# EAGLE design air (EAGLE 7.5.0)
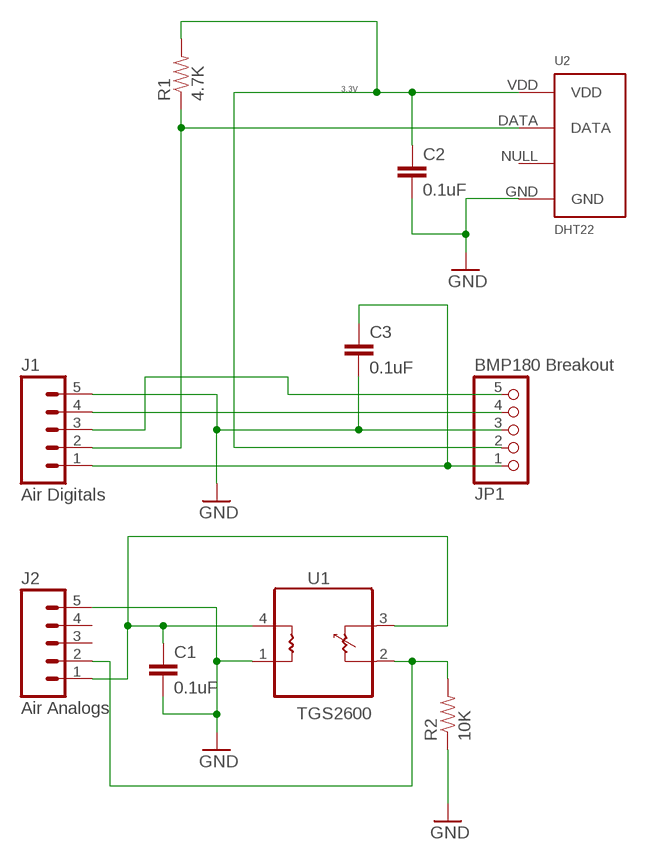
[diagram p0: schematic, sheet 1]

## Parts
C1  0.1uF  CAPPTH  [CAP-PTH-SMALL]
C2  0.1uF  CAPPTH  [CAP-PTH-SMALL]
C3  0.1uF  CAPPTH  [CAP-PTH-SMALL]
J1  Air Digitals  M05SCREW  [SCREWTERMINAL-3.5MM-5]
J2  Air Analogs  M05SCREW  [SCREWTERMINAL-3.5MM-5]
JP1  BMP180 Breakout  HEADER-1X570MIL  [1X05_ROUND_70]
R1  4.7K  RESISTORPTH-1/4W  [AXIAL-0.4]
R2  10K  RESISTORPTH-1/4W  [AXIAL-0.4]
U1  TGS2600  TGN2600  [TO5_AIRQ]
U2  DHT22  RHT03_DHT-22_AM2302WIRED  [AM2302]

## Nets
3.3V: C2.1 JP1.2 R1.P$2 U2.VDD
GND [power]: C1.2 C2.2 C3.2 J1.5 J2.5 JP1.3 R2.P$1 U1.1 U2.GND
N$1 [power]: C3.1 J1.1 JP1.1
N$2: J1.4 JP1.4
N$3: J1.2 R1.P$1 U2.DATA
N$4: J2.2 R2.P$2 U1.2
N$8 [power]: C1.1 J2.1 U1.3 U1.4
SDA: J1.3 JP1.5
Unconnected: J2.3 J2.4 U2.NULL

## Library data of the parts
C1-C3 = SparkFun-Capacitors:CAP: Capacitor Standard 0603 ceramic capacitor, and 0.1" leaded capacitor.
J1 J2 = SparkFun-Connectors:M05: Header 5 Standard 5-pin 0.1" header. Use with straight break away headers (SKU : PRT-00116), right angle break away headers (PRT-00553), swiss pins (PRT-00743), machine pins (PRT-00117), and female headers (PRT-00115). Molex polarized connector foot print use with SKU : PRT-08230 with associated crimp pins and housings.; PROD_ID: Combine 8288+8399
JP1 = microbuilder:HEADER-1X5: PIN HEADER
R1 R2 = SparkFun-Passives:RESISTOR: Resistor Basic schematic elements and footprints for 0603, 1206, and PTH resistors.
U1 = Jims:TGN2600
U2 = RHT03_DHT-22_AM2302:RHT03_DHT-22_AM2302: RHT03 / DHT-22 / AM2302 Packages and symbol for the RHT03 / DHT-22 relative humidity and temperature sensor. Note: The AM2302 is a wired version of the DHT-22 which typically requires less clearance and is thus provided as a separate package.; PROD_ID: SEN-10167

## Net classes
0 default: width 0.305 mm
1 power: width 1.016 mm

## Board
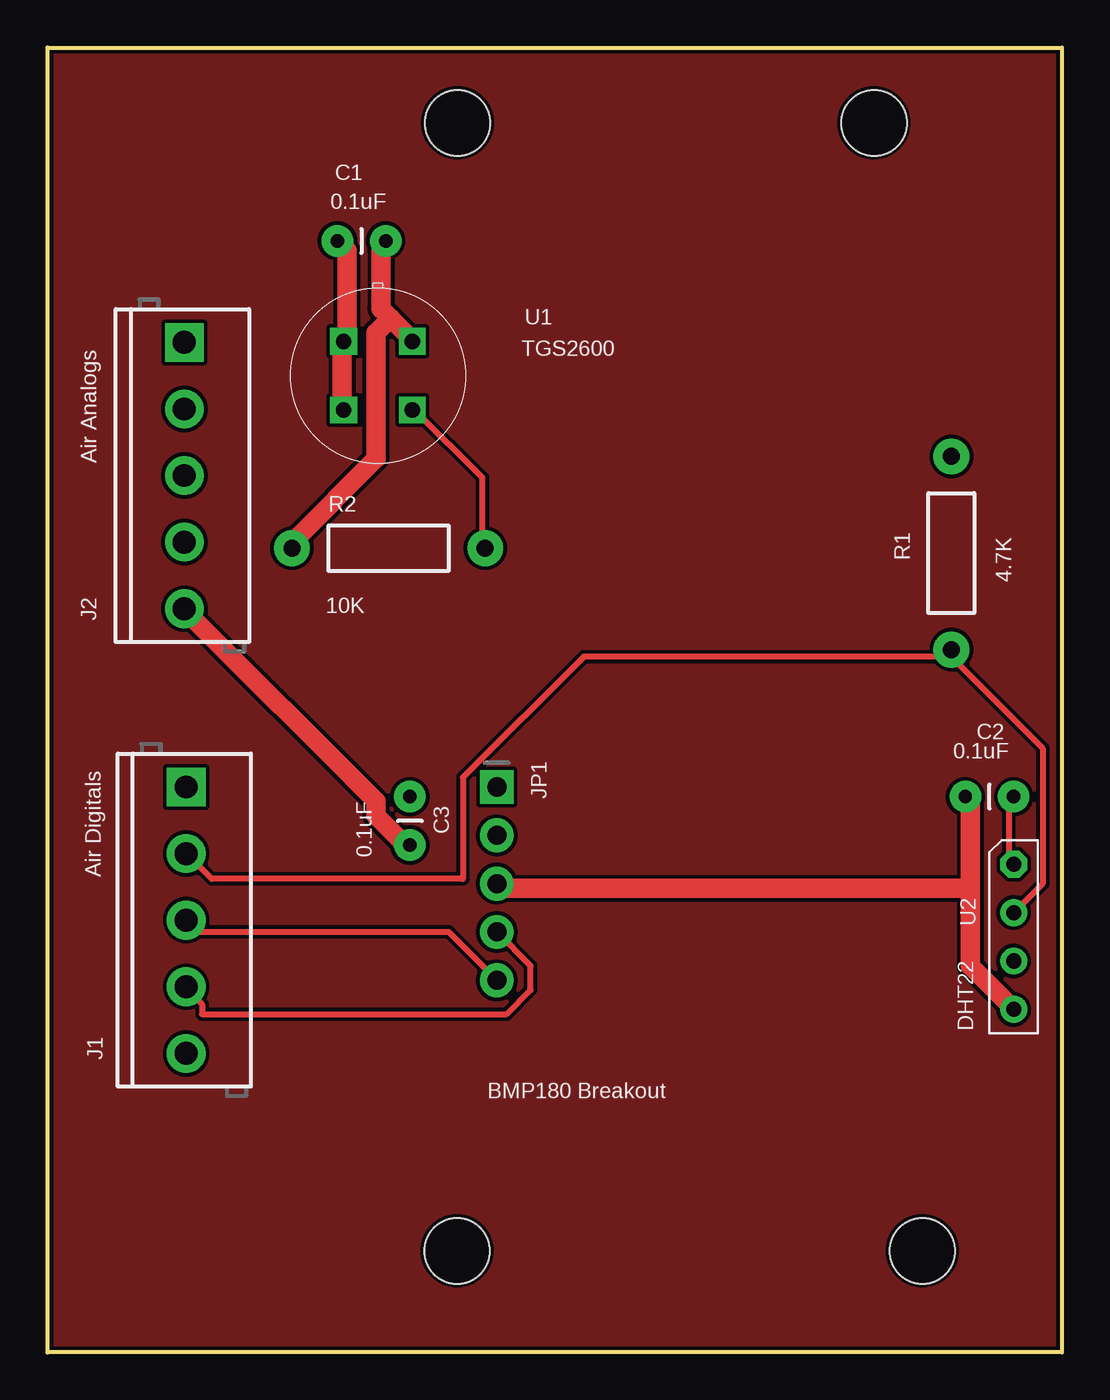
[diagram p1: board, top side]
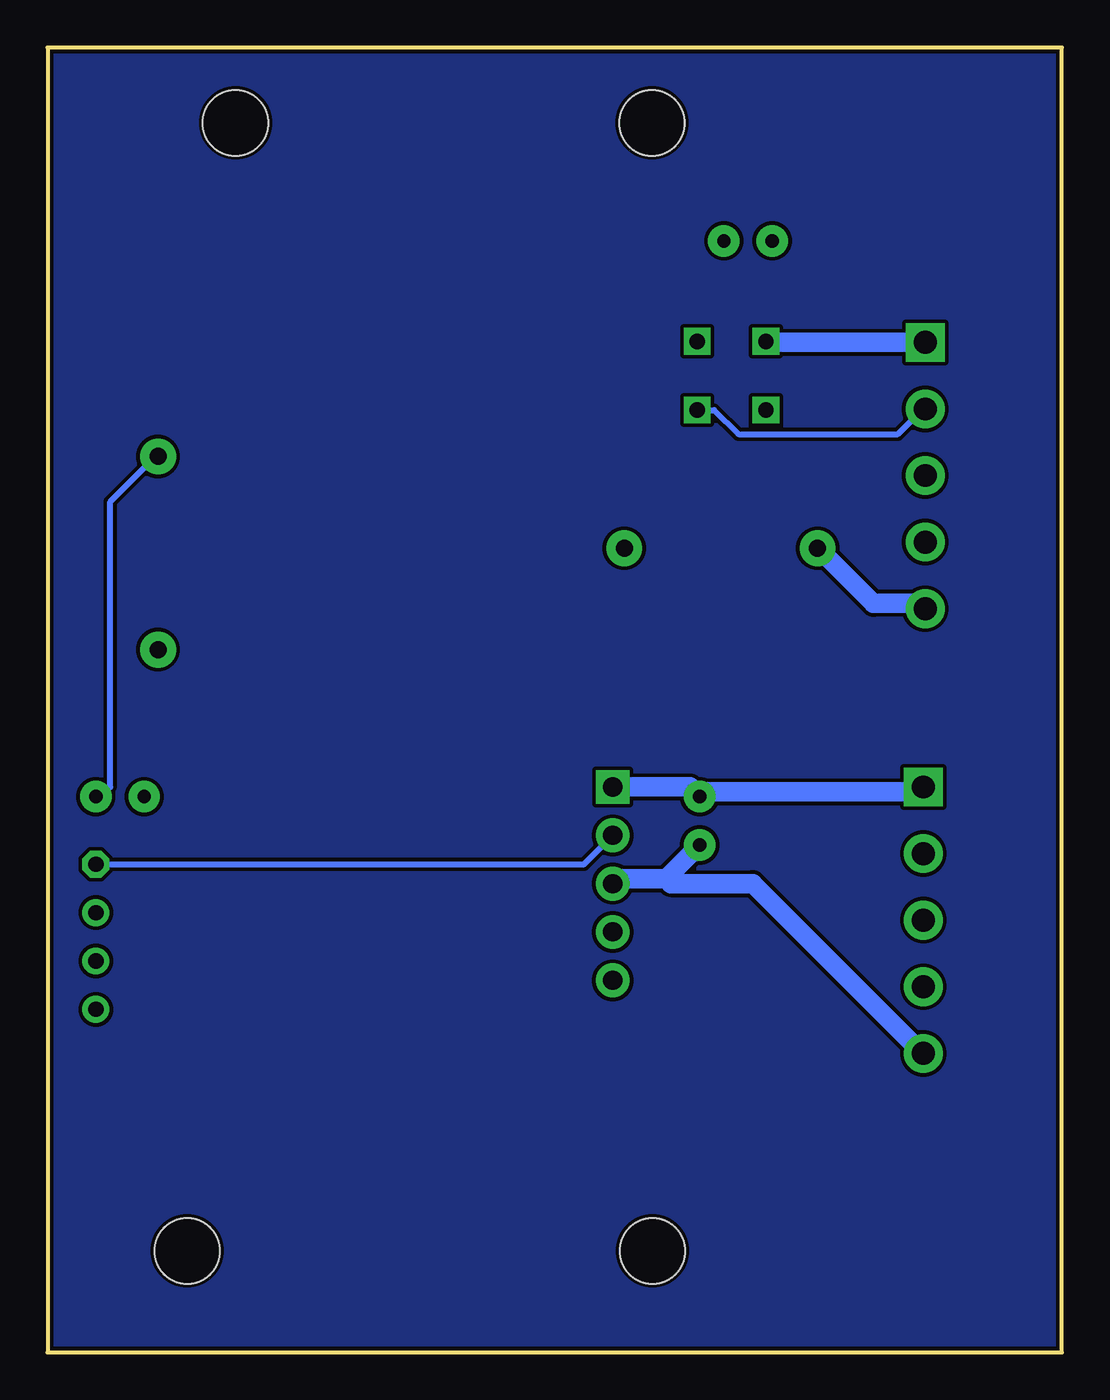
[diagram p2: board, bottom side, seen from below]

Size 53.34 x 68.58 mm. Coordinates in mm from the lower left corner, seen from the top.
Outline: 0,0 0,68.58 53.34,68.58 53.34,0 0,0
Copper layers (1*16): Top 0.035mm / dielectric 1.5mm / Bottom 0.035mm
Design rules "SparkFun": minimum track width 8mil, minimum drill 20mil, track to track 8mil, track to pad 8mil, pad to pad 8mil, via to via 8mil, smd to smd 8mil, copper to edge 8mil, drill to drill 8mil, minimum pad ring 12mil, minimum via ring 10mil, stop-mask expansion 4mil, vias tented up to drill 20mil, thermal gap 10mil
Holes 3.43 mm at 43.46,64.62 21.56,64.62 21.54,5.33 46,5.33

### Footprints (pad centres in the part's own frame; a part is rotated, then mirrored left to right if it is on the bottom)
CAP-PTH-SMALL = drill 0.7 pad 1.651: 1 0,0; 2 2.54,0
SCREWTERMINAL-3.5MM-5 = drill 1.2 pad 2.032 square: 1 0,0 | drill 1.2 pad 2.032: 2 3.5,0; 3 7,0; 4 10.5,0; 5 14,0
1X05_ROUND_70 = drill 1 pad 1.778 square: 1 -5.08,0 | drill 1 pad 1.778: 2 -2.54,0; 3 0,0; 4 2.54,0; 5 5.08,0
AXIAL-0.4 = drill 0.9 pad 1.88: P$1 -5.08,0; P$2 5.08,0
TO5_AIRQ = drill 0.8 square: 1 1.803,1.803; 2 1.803,-1.803; 3 -1.803,-1.803; 4 -1.803,1.803
AM2302 = drill 0.8: DATA -1.27,0; GND 3.81,0; NULL 1.27,0 | drill 0.8 octagon: VDD -3.81,0

### Placement (x,y rotation side)
C1  15.24,58.42 0 top
C2  50.8,29.21 180 top
C3  19.05,29.21 270 top
J1  7.29,29.72 270 top
J2  7.19,53.09 270 top
JP1  23.62,24.64 270 top
R1  47.52,42.01 90 top
R2  17.93,42.27 0 top
U1  17.37,51.33 0 top
U2  50.8,21.84 270 top

### Tracks (layer width: path | path; a pad name or v marks a point on that pad's centre or on a via)
3.3V
  Top 0.305: U2.VDD 50.55,25.91 50.55,28.96 C2.1
  Bottom 0.305: JP1.2 25.15,25.65 U2.VDD | C2.1 50.55,29.21 50.04,29.72 50.04,44.7 47.75,46.99 R1.P$2
GND
  Top 1.016: 18.03,54.36 17.53,54.86 17.53,57.91 17.78,58.17 C1.2 | 18.03,54.36 19.05,53.34 U1.1 | 18.03,54.36 17.27,53.59 17.27,46.99 12.95,42.67 12.95,42.42 R2.P$1 | U2.GND 48.51,20.32 48.51,24.38 | 48.51,24.38 48.51,28.7 48.26,28.96 C2.2 | 48.51,24.38 23.62,24.38 JP1.3 | C3.2 18.8,26.67 17.27,28.19 17.27,28.96 7.37,38.86 J2.5
  Bottom 1.016: R2.P$1 12.7,42.16 9.91,39.37 7.62,39.37 7.37,39.12 J2.5 | 20.83,24.89 C3.2 | 20.83,24.89 23.37,24.89 JP1.3 | J1.5 7.37,15.75 16.26,24.64 20.57,24.64 20.83,24.89
N$1
  Bottom 1.016: JP1.1 19.56,29.72 C3.1 18.8,29.46 7.62,29.46 7.37,29.72 J1.1
N$2
  Top 0.305: JP1.4 25.4,20.32 25.4,19.05 24.13,17.78 8.13,17.78 8.13,18.29 7.37,19.05 J1.4
N$3
  Top 0.305: U2.DATA 52.32,24.64 52.32,31.75 47.75,36.32 47.75,36.83 R1.P$1 47.5,36.83 47.5,36.58 28.19,36.58 21.84,30.23 21.84,24.89 8.64,24.89 7.37,26.16 J1.2
N$4
  Top 0.305: U1.2 19.3,49.53 22.86,45.97 22.86,42.42 R2.P$2
  Bottom 0.305: U1.2 18.29,49.53 17.02,48.26 8.64,48.26 7.37,49.53 J2.2
N$5
  pour Top: 0,0 0,68.58 53.34,68.58 53.34,0
N$6
  pour Bottom: 0,0 0,68.58 53.34,68.58 53.34,0
N$8
  Top 1.016: U1.3 15.49,49.53 15.49,53.09 U1.4 15.75,53.59 15.75,57.91 C1.1
  Bottom 1.016: J2.1 15.49,53.09 U1.4
SDA
  Top 0.305: JP1.5 21.08,22.1 7.37,22.1 7.37,22.61 J1.3